# Altium schematic sheet elv_connector.SchDoc
size A4
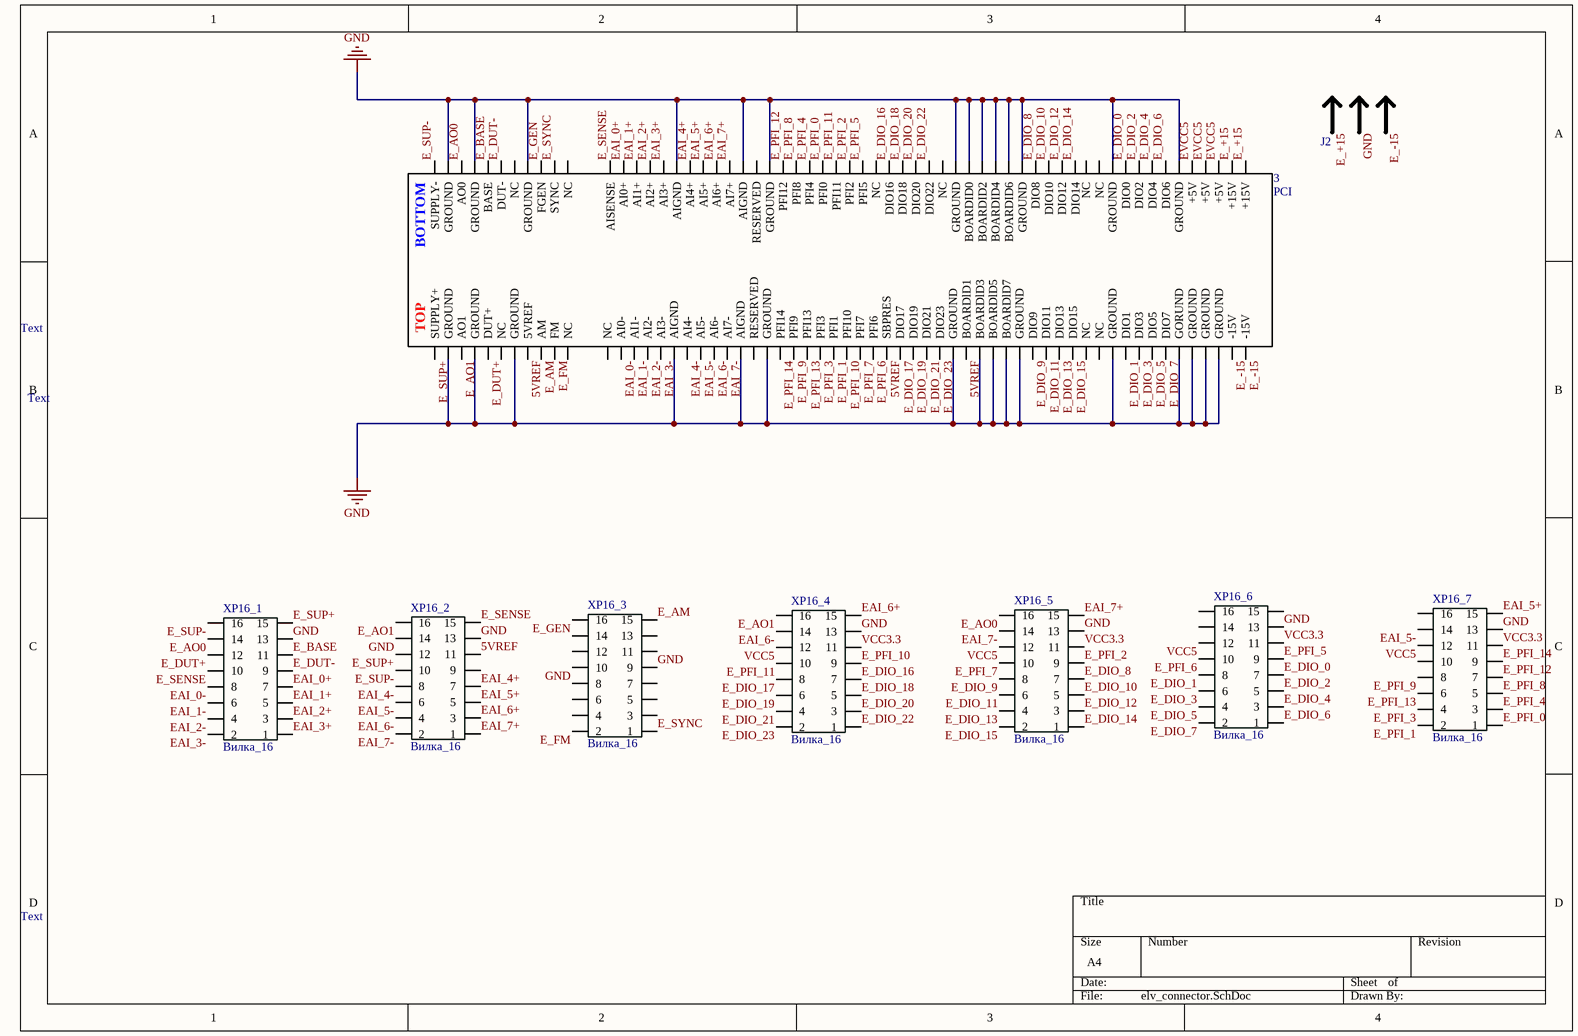
[diagram p0: elv_connector.SchDoc]

## Parts
3  PCI  [PCI-120]
J2  JUMPER_SWITCH_2S  [JUMPER_SWITCH_2S]  (value not drawn)
XP16_1  Вилка_16  [DS1013-16]
XP16_2  Вилка_16  [DS1013-16]
XP16_3  Вилка_16  [DS1013-16]
XP16_4  Вилка_16  [DS1013-16]
XP16_5  Вилка_16  [DS1013-16]
XP16_6  Вилка_16  [DS1013-16]
XP16_7  Вилка_16  [DS1013-16]

## Nets
GND: 3.1(GROUND) 3.3(GROUND) 3.6(GROUND) 3.16(AIGND) 3.21(AIGND) 3.23(GROUND) 3.37(GROUND) 3.39(BOARDlD3) 3.40(BOARDlD5) 3.41(BOARDlD7) 3.42(GROUND) 3.49(GROUND) 3.54(GORUND) 3.55(GROUND) 3.56(GROUND) 3.57(GROUND) 3.65(GROUND) 3.70(GROUND) 3.77(GROUND) 3.78(BOARDID6) 3.79(BOARDID4) 3.80(BOARDID2) 3.81(BOARDID0) 3.82(GROUND) 3.96(GROUND) 3.98(AIGND) 3.103(AIGND) 3.112(GROUND) 3.116(GROUND) 3.118(GROUND) J2.0 XP16_1.13 XP16_2.13 XP16_2.14 XP16_3.9 XP16_3.10 XP16_4.13 XP16_5.13 XP16_6.13 XP16_7.13
5VREF: 3.7(5VREF) 3.32(SBPRES) 3.38(BOARDlD1) XP16_2.11
E_+15: 3.60(+15V) 3.61(+15V) J2.1
E_-15: 3.58(-15V) 3.59(-15V) J2.2
E_AM: 3.8(AM) XP16_3.15
E_AO0: 3.117(AO0) XP16_1.14 XP16_5.16
E_AO1: 3.2(AO1) XP16_2.16 XP16_4.16
E_BASE: 3.115(BASE) XP16_1.11
E_DIO_0: 3.69(DIO0) XP16_6.7
E_DIO_1: 3.50(DIO1) XP16_6.8
E_DIO_2: 3.68(DIO2) XP16_6.5
E_DIO_3: 3.51(DIO3) XP16_6.6
E_DIO_4: 3.67(DIO4) XP16_6.3
E_DIO_5: 3.52(DIO5) XP16_6.4
E_DIO_6: 3.66(DIO6) XP16_6.1
E_DIO_7: 3.53(DIO7) XP16_6.2
E_DIO_8: 3.76(DIO8) XP16_5.7
E_DIO_9: 3.43(DIO9) XP16_5.8
E_DIO_10: 3.75(DIO10) XP16_5.5
E_DIO_11: 3.44(DIO11) XP16_5.6
E_DIO_12: 3.74(DIO12) XP16_5.3
E_DIO_13: 3.45(DIO13) XP16_5.4
E_DIO_14: 3.73(DIO14) XP16_5.1
E_DIO_15: 3.46(DIO15) XP16_5.2
E_DIO_16: 3.87(DIO16) XP16_4.7
E_DIO_17: 3.33(DIO17) XP16_4.8
E_DIO_18: 3.86(DIO18) XP16_4.5
E_DIO_19: 3.34(DIO19) XP16_4.6
E_DIO_20: 3.85(DIO20) XP16_4.3
E_DIO_21: 3.35(DIO21) XP16_4.4
E_DIO_22: 3.84(DIO22) XP16_4.1
E_DIO_23: 3.36(DIO23) XP16_4.2
E_DUT+: 3.4(DUT+) XP16_1.12
E_DUT-: 3.114(DUT-) XP16_1.9
E_FM: 3.9(FM) XP16_3.2
E_GEN: 3.111(FGEN) XP16_3.16
E_PFI_0: 3.92(PFI0) XP16_7.1
E_PFI_1: 3.28(PFI1) XP16_7.2
E_PFI_2: 3.90(PFI2) XP16_5.9
E_PFI_3: 3.27(PFI3) XP16_7.4
E_PFI_4: 3.93(PFI4) XP16_7.3
E_PFI_5: 3.89(PFI5) XP16_6.9
E_PFI_6: 3.31(PFI6) XP16_6.10
E_PFI_7: 3.30(PFI7) XP16_5.10
E_PFI_8: 3.94(PFI8) XP16_7.5
E_PFI_9: 3.25(PFI9) XP16_7.8
E_PFI_10: 3.29(PFI10) XP16_4.9
E_PFI_11: 3.91(PFI11) XP16_4.10
E_PFI_12: 3.95(PFI12) XP16_7.7
E_PFI_13: 3.26(PFI13) XP16_7.6
E_PFI_14: 3.24(PFI14) XP16_7.9
E_SENSE: 3.108(AISENSE) XP16_1.10 XP16_2.15
E_SUP+: 3.0(SUPPLY+) XP16_1.15 XP16_2.12
E_SUP-: 3.119(SUPPLY-) XP16_1.16 XP16_2.10
E_SYNC: 3.110(SYNC) XP16_3.1
EAI_0+: 3.107(AI0+) XP16_1.7
EAI_0-: 3.12(AI0-) XP16_1.8
EAI_1+: 3.106(AI1+) XP16_1.5
EAI_1-: 3.13(AI1-) XP16_1.6
EAI_2+: 3.105(AI2+) XP16_1.3
EAI_2-: 3.14(AI2-) XP16_1.4
EAI_3+: 3.104(AI3+) XP16_1.1
EAI_3-: 3.15(AI3-) XP16_1.2
EAI_4+: 3.102(AI4+) XP16_2.7
EAI_4-: 3.17(AI4-) XP16_2.8
EAI_5+: 3.101(AI5+) XP16_2.5 XP16_7.15
EAI_5-: 3.18(AI5-) XP16_2.6 XP16_7.14
EAI_6+: 3.100(AI6+) XP16_2.3 XP16_4.15
EAI_6-: 3.19(AI6-) XP16_2.4 XP16_4.14
EAI_7+: 3.99(AI7+) XP16_2.1 XP16_5.15
EAI_7-: 3.20(AI7-) XP16_2.2 XP16_5.14
EVCC5: 3.62(+5V) 3.63(+5V) 3.64(+5V)
VCC3.3: XP16_4.11 XP16_5.11 XP16_6.11 XP16_7.11
VCC5: XP16_4.12 XP16_5.12 XP16_6.12 XP16_7.12

Not connected (* = marked no-connect by the designer): 3 5(NC) 10(NC) 11(NC) 22(RESERVED) 47(NC) 48(NC) 71(NC) 72(NC) 83(NC) 88(NC) 97(RESERVED) 109(NC) 113(NC); XP16_2 9; XP16_3 3 4 5 6 7 8 11 12 13 14; XP16_6 14 15 16; XP16_7 10 16

## Notes on the sheet
- Text
- (in symbol PCI) BOTTOM; TOP

## Library data of the parts
J2 = JUMPER_SWITCH_2S: 2 state jumper switch
XP16_1-XP16_7 = DS1013-16: 16_pin